# Altium schematic sheet Timer_Register.SchDoc
size B; Author: E. Sims; Organization: Let's Build Rockets Inc.; SheetNumber: 9; SheetTotal: 16
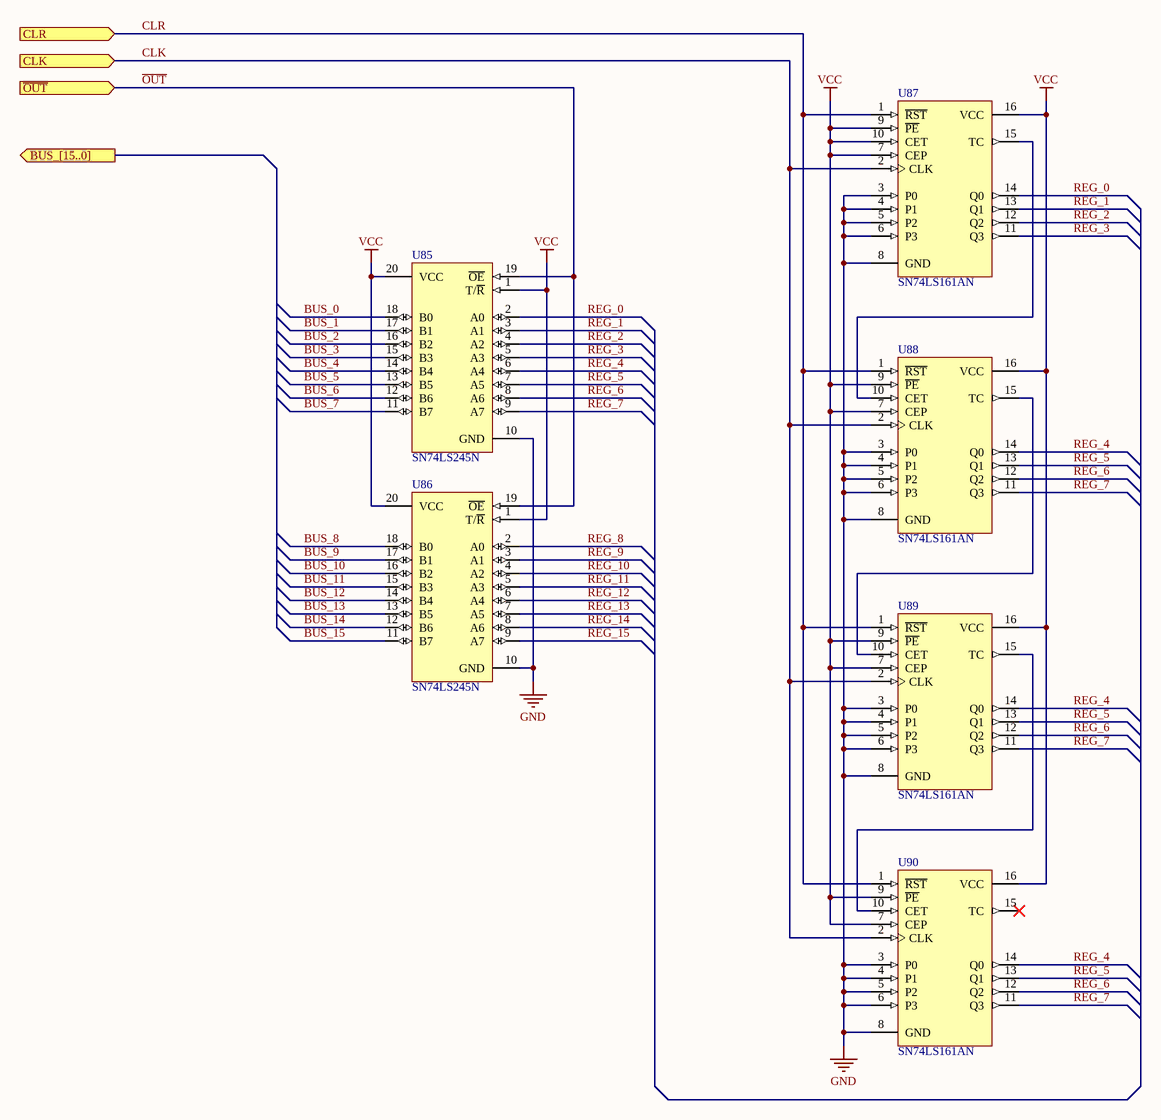
[diagram p0: Timer_Register.SchDoc]

## Parts
U85  SN74LS245N  [N020]
U86  SN74LS245N  [N020]
U87  SN74LS161AN  [N016]
U88  SN74LS161AN  [N016]
U89  SN74LS161AN  [N016]
U90  SN74LS161AN  [N016]

## Ports
BUS_[15..0] (out), CLK (in), CLR (in), ~{OUT} (in)

## Nets
GND: U85.10(GND) U86.10(GND) U87.3(P0) U87.4(P1) U87.5(P2) U87.6(P3) U87.8(GND) U88.3(P0) U88.4(P1) U88.5(P2) U88.6(P3) U88.8(GND) U89.3(P0) U89.4(P1) U89.5(P2) U89.6(P3) U89.8(GND) U90.3(P0) U90.4(P1) U90.5(P2) U90.6(P3) U90.8(GND)
VCC: U85.1(T/~{R}) U85.20(VCC) U86.1(T/~{R}) U86.20(VCC) U87.7(CEP) U87.9(~{PE}) U87.10(CET) U87.16(VCC) U88.7(CEP) U88.9(~{PE}) U88.16(VCC) U89.7(CEP) U89.9(~{PE}) U89.16(VCC) U90.7(CEP) U90.9(~{PE}) U90.16(VCC)
BUS_0: U85.18(B0)
BUS_1: U85.17(B1)
BUS_2: U85.16(B2)
BUS_3: U85.15(B3)
BUS_4: U85.14(B4)
BUS_5: U85.13(B5)
BUS_6: U85.12(B6)
BUS_7: U85.11(B7)
BUS_8: U86.18(B0)
BUS_9: U86.17(B1)
BUS_10: U86.16(B2)
BUS_11: U86.15(B3)
BUS_12: U86.14(B4)
BUS_13: U86.13(B5)
BUS_14: U86.12(B6)
BUS_15: U86.11(B7)
CLK: U87.2(CLK) U88.2(CLK) U89.2(CLK) U90.2(CLK) ; port CLK
CLR: U87.1(~{RST}) U88.1(~{RST}) U89.1(~{RST}) U90.1(~{RST}) ; port CLR
~{OUT}: U85.19(~{OE}) U86.19(~{OE}) ; port ~{OUT}
REG_0: U85.2(A0) U87.14(Q0)
REG_1: U85.3(A1) U87.13(Q1)
REG_2: U85.4(A2) U87.12(Q2)
REG_3: U85.5(A3) U87.11(Q3)
REG_4: U85.6(A4) U88.14(Q0) U89.14(Q0) U90.14(Q0)
REG_5: U85.7(A5) U88.13(Q1) U89.13(Q1) U90.13(Q1)
REG_6: U85.8(A6) U88.12(Q2) U89.12(Q2) U90.12(Q2)
REG_7: U85.9(A7) U88.11(Q3) U89.11(Q3) U90.11(Q3)
REG_8: U86.2(A0)
REG_9: U86.3(A1)
REG_10: U86.4(A2)
REG_11: U86.5(A3)
REG_12: U86.6(A4)
REG_13: U86.7(A5)
REG_14: U86.8(A6)
REG_15: U86.9(A7)
NetU87_15: U87.15(TC) U88.10(CET)
NetU88_15: U88.15(TC) U89.10(CET)
NetU89_15: U89.15(TC) U90.10(CET)

Not connected (* = marked no-connect by the designer): U90 15(TC)*

## Notes on the sheet
- Let's Build Rocket's Inc. Modular Paylaod System Based on TMP-010 Rev
  For more information visit https://github.com/LetsBuildRockets/Modular-Payload-System
  This work is licensed under CC BY-NC 4.0. To view a copy of this license, visit https://creativecommons.org/licenses/by-nc/4.0
- Title
- Size:
- Date:
- Assembly Variant:
- B
- Number:
- Time:
- Revision:
- Sheet
- of
- Author:
- File:

## Library data of the parts
U85 U86 = SN74LS245N: Octal Bus Transceiver with 3-State Outputs; Published: 8-Jun-2000; LatestRevisionDate: 04-Mar-2005; LatestRevisionNote: Stylized 3D Model Added.; DatasheetVersion: Mar-1988; PackageVersion: Oct-1995; PackageReference: N020; Publisher: Altium Limited; PackageDescription: DIP; 20 Leads; Row Spacing 7.62 mm; Pitch 2.54 mm; ComponentLink1Description: Manufacturer Link; ComponentLink1URL: http://www.ti.com/; ComponentLink2Description: Datasheet; ComponentLink2URL: http://www-s.ti.com/sc/ds/sn74ls245.pdf
U87-U90 = SN74LS161AN: Synchronous 4-Bit Counter; Published: 8-Jun-2000; LatestRevisionDate: 04-Mar-2005; LatestRevisionNote: Stylized 3D Model Added.; DatasheetVersion: Mar-1988; PackageVersion: Oct-1995; PackageReference: N016; Publisher: Altium Limited; PackageDescription: DIP; 16 Leads; Row Spacing 7.62 mm; Pitch 2.54 mm; Code_JEDEC: MS-001-BB; ComponentLink1Description: Manufacturer Link; ComponentLink1URL: http://www.ti.com/; ComponentLink2Description: Datasheet; ComponentLink2URL: http://www-s.ti.com/sc/ds/sn74ls161a.pdf; ComponentLink3Description: URL Link1; ComponentLink3URL: http://focus.ti.com/docs/prod/folders/print/sn74ls161a.html